# EAGLE design mixer-board4 (EAGLE 9.6.2)
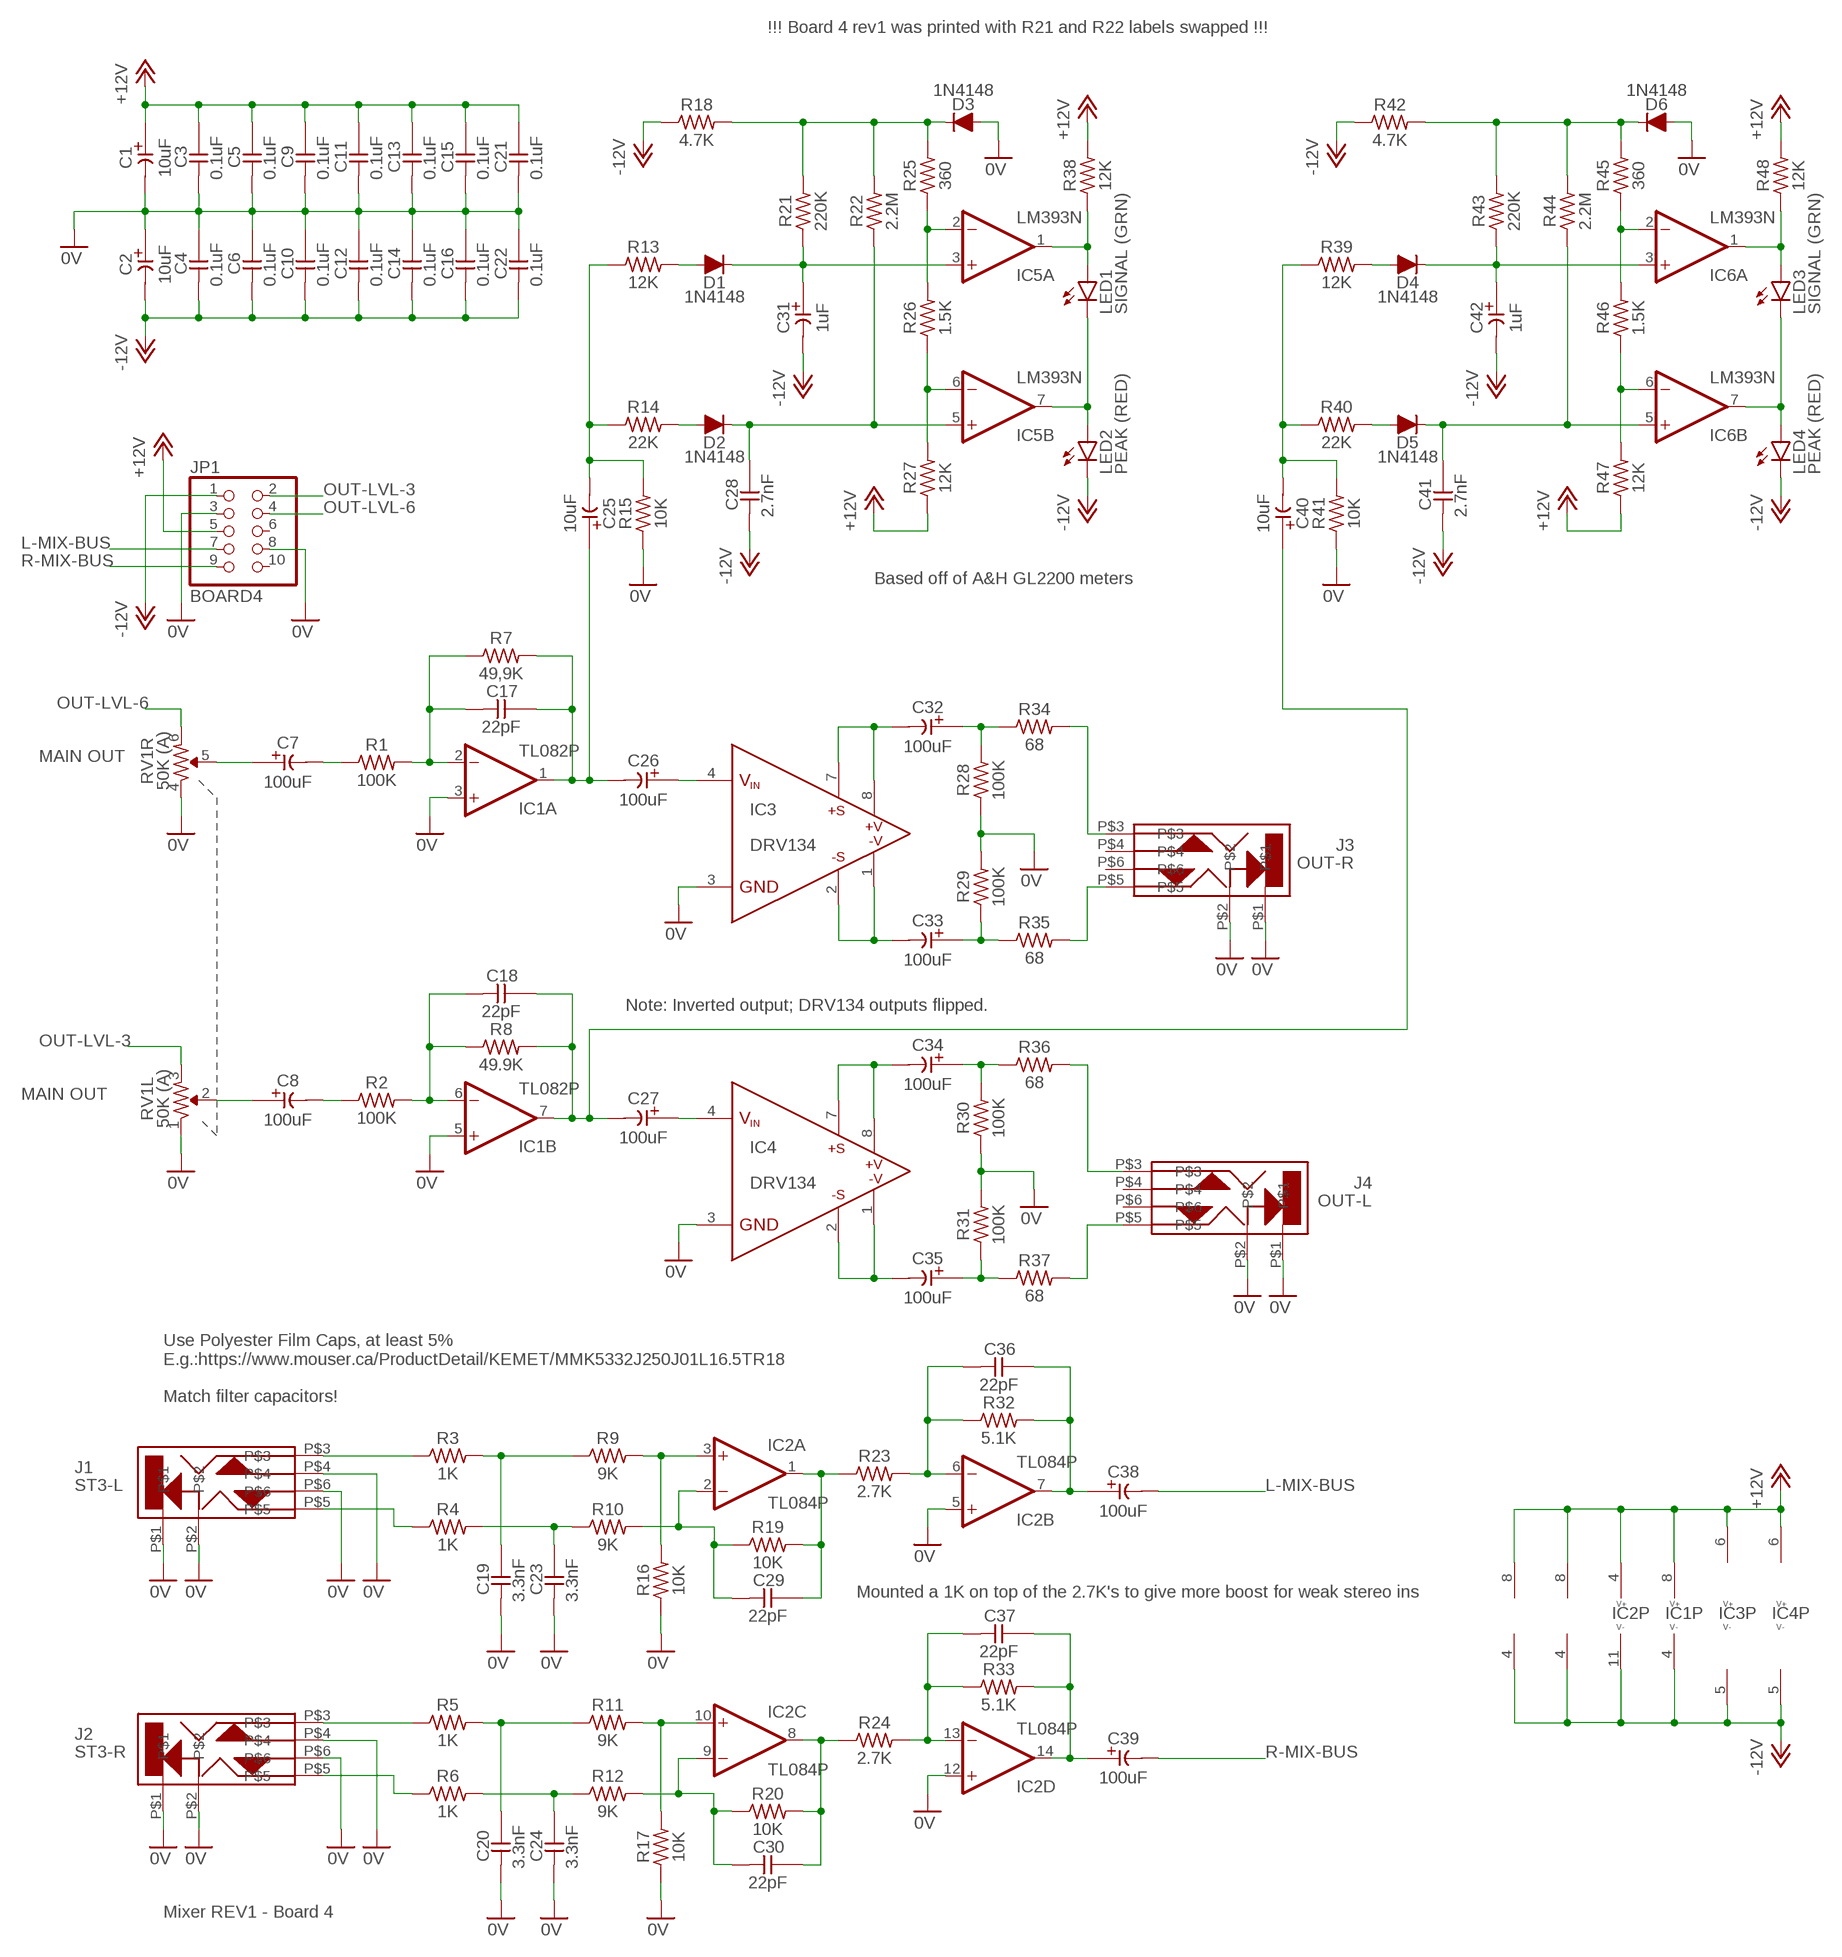
[diagram p0: schematic, sheet 1]

## Parts
C1  10uF  CE-USE2-5  [E2-5]
C2  10uF  CE-USE2-5  [E2-5]
C3  0.1uF  CC-US025-024X044  [C025-024X044]
C4  0.1uF  CC-US025-024X044  [C025-024X044]
C5  0.1uF  CC-US025-024X044  [C025-024X044]
C6  0.1uF  CC-US025-024X044  [C025-024X044]
C7  100uF  CE-USE5-8.5  [E5-8,5]
C8  100uF  CE-USE5-8.5  [E5-8,5]
C9  0.1uF  CC-US025-024X044  [C025-024X044]
C10  0.1uF  CC-US025-024X044  [C025-024X044]
C11  0.1uF  CC-US025-024X044  [C025-024X044]
C12  0.1uF  CC-US025-024X044  [C025-024X044]
C13  0.1uF  CC-US025-024X044  [C025-024X044]
C14  0.1uF  CC-US025-024X044  [C025-024X044]
C15  0.1uF  CC-US025-024X044  [C025-024X044]
C16  0.1uF  CC-US025-024X044  [C025-024X044]
C17  22pF  CC-US025-024X044  [C025-024X044]
C18  22pF  CC-US025-024X044  [C025-024X044]
C19  3.3nF  CC-US050-024X044  [C050-024X044]
C20  3.3nF  CC-US050-024X044  [C050-024X044]
C21  0.1uF  CC-US025-024X044  [C025-024X044]
C22  0.1uF  CC-US025-024X044  [C025-024X044]
C23  3.3nF  CC-US050-024X044  [C050-024X044]
C24  3.3nF  CC-US050-024X044  [C050-024X044]
C25  10uF  CE-USE2-5  [E2-5]
C26  100uF  CE-USE5-8.5  [E5-8,5]
C27  100uF  CE-USE5-8.5  [E5-8,5]
C28  2.7nF  CC-US025-024X044  [C025-024X044]
C29  22pF  CC-US025-024X044  [C025-024X044]
C30  22pF  CC-US025-024X044  [C025-024X044]
C31  1uF  CE-USE2-5  [E2-5]
C32  100uF  CE-USE5-8.5  [E5-8,5]
C33  100uF  CE-USE5-8.5  [E5-8,5]
C34  100uF  CE-USE5-8.5  [E5-8,5]
C35  100uF  CE-USE5-8.5  [E5-8,5]
C36  22pF  CC-US025-024X044  [C025-024X044]
C37  22pF  CC-US025-024X044  [C025-024X044]
C38  100uF  CE-USE5-8.5  [E5-8,5]
C39  100uF  CE-USE5-8.5  [E5-8,5]
C40  10uF  CE-USE2-5  [E2-5]
C41  2.7nF  CC-US025-024X044  [C025-024X044]
C42  1uF  CE-USE2-5  [E2-5]
D1  1N4148  [DO34-5]
D2  1N4148  [DO34-5]
D3  1N4148  [DO34-5]
D4  1N4148  [DO34-5]
D5  1N4148  [DO34-5]
D6  1N4148  [DO34-5]
IC1  TL082P  [DIL08]
IC2  TL084P  [DIL14]
IC3  DRV134  [DIL08]
IC4  DRV134  [DIL08]
IC5  LM393N  [DIL08]
IC6  LM393N  [DIL08]
J1  ST3-L  NYS216-U  [NYS216-U]
J2  ST3-R  NYS216-U  [NYS216-U]
J3  OUT-R  NYS216-U  [NYS216-U]
J4  OUT-L  NYS216-U  [NYS216-U]
JP1  BOARD4  PINHD-2X5  [2X05]
LED1  SIGNAL (GRN)  LED3MM  [LED3MM]
LED2  PEAK (RED)  LED3MM  [LED3MM]
LED3  SIGNAL (GRN)  LED3MM  [LED3MM]
LED4  PEAK (RED)  LED3MM  [LED3MM]
R1  100K  R  [0207/7]
R2  100K  R  [0207/7]
R3  1K  R  [0207/7]
R4  1K  R  [0207/7]
R5  1K  R  [0207/7]
R6  1K  R  [0207/7]
R7  49,9K  R  [0207/7]
R8  49.9K  R  [0207/7]
R9  9K  R  [0207/7]
R10  9K  R  [0207/7]
R11  9K  R  [0207/7]
R12  9K  R  [0207/7]
R13  12K  R  [0207/7]
R14  22K  R  [0207/7]
R15  10K  R  [0207/7]
R16  10K  R  [0207/7]
R17  10K  R  [0207/7]
R18  4.7K  R  [0207/7]
R19  10K  R  [0207/7]
R20  10K  R  [0207/7]
R21  220K  R  [0207/7]
R22  2.2M  R  [0207/7]
R23  2.7K  R  [0207/7]
R24  2.7K  R  [0207/7]
R25  360  R  [0207/7]
R26  1.5K  R  [0207/7]
R27  12K  R  [0207/7]
R28  100K  R  [0207/7]
R29  100K  R  [0207/7]
R30  100K  R  [0207/7]
R31  100K  R  [0207/7]
R32  5.1K  R  [0207/7]
R33  5.1K  R  [0207/7]
R34  68  R  [0207/7]
R35  68  R  [0207/7]
R36  68  R  [0207/7]
R37  68  R  [0207/7]
R38  12K  R  [0207/7]
R39  12K  R  [0207/7]
R40  22K  R  [0207/7]
R41  10K  R  [0207/7]
R42  4.7K  R  [0207/7]
R43  220K  R  [0207/7]
R44  2.2M  R  [0207/7]
R45  360  R  [0207/7]
R46  1.5K  R  [0207/7]
R47  12K  R  [0207/7]
R48  12K  R  [0207/7]
RV1  50K (A)  R-VAR-ST  [_COMMON_3RP/1610G]

## Nets
0V [power]: C1.- C2.+ C3.2 C4.1 C5.2 C6.1 C9.2 C10.1 C11.2 C12.1 C13.2 C14.1 C15.2 C16.1 C19.2 C20.2 C21.2 C22.1 C23.2 C24.2 D3.A D6.A IC1.3(A:+IN) IC1.5(B:+IN) IC2.5(B:+IN) IC2.12(D:+IN) IC3.3(GND) IC4.3(GND) J1.P$1 J1.P$2 J1.P$4 J1.P$6 J2.P$1 J2.P$2 J2.P$4 J2.P$6 J3.P$1 J3.P$2 J4.P$1 J4.P$2 JP1.3 JP1.8 R15.1 R16.1 R17.1 R28.1 R29.2 R30.1 R31.2 R41.1 RV1.1 RV1.4
+12V [power]: C1.+ C3.1 C5.1 C9.1 C11.1 C13.1 C15.1 C21.1 IC1.8(P:V+) IC2.4(P:V+) IC3.6(V+) IC4.6(V+) IC5.8(P:V+) IC6.8(P:V+) JP1.5 R27.1 R38.2 R47.1 R48.2
-12V [power]: C2.- C4.2 C6.2 C10.2 C12.2 C14.2 C16.2 C22.2 C28.2 C31.- C41.2 C42.- IC1.4(P:V-) IC2.11(P:V-) IC3.5(V-) IC4.5(V-) IC5.4(P:V-) IC6.4(P:V-) JP1.1 LED2.K(C) LED4.K(C) R18.1 R42.1
L-MIX-BUS: C38.- JP1.7
N$1: J2.P$3 R5.1
N$2: C20.1 R5.2 R11.1
N$3: IC2.10(C:+IN) R11.2 R17.2
N$4: C24.1 R6.2 R12.1
N$5: C30.2 IC2.9(C:-IN) R12.2 R20.1
N$6: J2.P$5 R6.1
N$7: C37.2 IC2.13(D:-IN) R24.2 R33.1
N$8: C30.1 IC2.8(C:OUT) R20.2 R24.1
N$9: J1.P$3 R3.1
N$10: C37.1 C39.+ IC2.14(D:OUT) R33.2
N$11: C19.1 R3.2 R9.1
N$12: IC2.3(A:+IN) R9.2 R16.2
N$13: C29.1 IC2.1(A:OUT) R19.2 R23.1
N$14: C36.2 IC2.6(B:-IN) R23.2 R32.1
N$15: C36.1 C38.+ IC2.7(B:OUT) R32.2
N$16: C23.1 R4.2 R10.1
N$17: J1.P$5 R4.1
N$20: C29.2 IC2.2(A:-IN) R10.2 R19.1
N$21: C7.+ RV1.5
N$22: C17.1 C25.+ C26.- IC1.1(A:OUT) R7.2
N$23: C8.+ RV1.2
N$24: C17.2 IC1.2(A:-IN) R1.2 R7.1
N$25: C8.- R2.1
N$26: C18.2 IC1.6(B:-IN) R2.2 R8.1
N$27: C18.1 C27.- C40.+ IC1.7(B:OUT) R8.2
N$28: C7.- R1.1
N$29: C32.- IC3.7(+SENSE) IC3.8(+V0)
N$30: C33.- IC3.1(-V0) IC3.2(-SENSE)
N$31: J4.P$3 R36.2
N$32: J4.P$5 R37.2
N$33: J3.P$5 R35.2
N$34: C26.+ IC3.4(VIN)
N$35: C27.+ IC4.4(VIN)
N$36: J3.P$3 R34.2
N$37: C35.- IC4.1(-V0) IC4.2(-SENSE)
N$38: C34.- IC4.7(+SENSE) IC4.8(+V0)
N$39: C34.+ R30.2 R36.1
N$40: C35.+ R31.1 R37.1
N$41: C33.+ R29.1 R35.1
N$42: C32.+ R28.2 R34.1
N$43: C25.- R13.1 R14.1 R15.2
N$44: D2.A R14.2
N$45: D1.A R13.2
N$46: C31.+ D1.C IC5.3(A:+IN) R21.1
N$47: C28.1 D2.C IC5.5(B:+IN) R22.1
N$48: IC5.6(B:-IN) R26.1 R27.2
N$49: IC5.2(A:-IN) R25.1 R26.2
N$50: D3.C R18.2 R21.2 R22.2 R25.2
N$51: IC5.1(A:OUT) LED1.A R38.1
N$52: IC5.7(B:OUT) LED1.K(C) LED2.A
N$53: C40.- R39.1 R40.1 R41.2
N$54: D5.A R40.2
N$55: D4.A R39.2
N$56: C42.+ D4.C IC6.3(A:+IN) R43.1
N$57: C41.1 D5.C IC6.5(B:+IN) R44.1
N$58: IC6.6(B:-IN) R46.1 R47.2
N$59: IC6.2(A:-IN) R45.1 R46.2
N$60: D6.C R42.2 R43.2 R44.2 R45.2
N$61: IC6.1(A:OUT) LED3.A R48.1
N$62: IC6.7(B:OUT) LED3.K(C) LED4.A
OUT-LVL-3: JP1.2 RV1.3
OUT-LVL-6: JP1.4 RV1.6
R-MIX-BUS: C39.- JP1.9
Unconnected: J3.P$4 J3.P$6 J4.P$4 J4.P$6 JP1.6 JP1.10

## Notes on the sheet
- !!! Board 4 rev1 was printed with R21 and R22 labels swapped !!!
- Based off of A&H GL2200 meters
- MAIN OUT
- Note: Inverted output; DRV134 outputs flipped.
- MAIN OUT
- Use Polyester Film Caps, at least 5%
  E.g.:https://www.mouser.ca/ProductDetail/KEMET/MMK5332J250J01L16.5TR18
  
  Match filter capacitors!
- Mounted a 1K on top of the 2.7K's to give more boost for weak stereo ins
- Mixer REV1 - Board 4

## Library data of the parts
C1 C2 C7 C8 C25-C27 C31-C35 C38-C40 C42 = _common:CE-US: ELECTROLYTIC CAPACITOR, US symbol
C3-C6 C9-C24 C28-C30 C36 C37 C41 = _common:CC-US: CAPACITOR, US symbol
D1-D6 = _common:1N4148: DIODE high speed (Philips)
IC1 = _common:TL082: OP AMP
IC2 = _common:TL084: OP AMP
IC3 IC4 = _common:DRV134: Texas Instruments AUDIO LINE DRIVER https://www.mouser.ca/ProductDetail/Texas-Instruments/DRV134PA Note: Scheduled for obsolescence and will be discontinued by the manufacturer.
IC5 IC6 = linear:LM393: COMPARATOR
J1-J4 = jacks:NYS216-U: https://www.mouser.ca/ProductDetail/REAN/NYS216-U Stereo (TRS) 1/4" Jack
JP1 = pinhead:PINHD-2X5: PIN HEADER
LED1-LED4 = led:LED: LED OSRAM: - CHIPLED LG R971, LG N971, LY N971, LG Q971, LY Q971, LO R971, LY R971 LH N974, LH R974 LS Q976, LO Q976, LY Q976 LO Q996 - Hyper CHIPLED LW Q18S LB Q993, LB Q99A, LB R99A - SideLED LS A670, LO A670, LY A670, LG A670, LP A670 LB A673, LV A673, LT A673, LW A673 LH A674 LY A675 LS A676, LA A676, LO A676, LY A676, LW A676 LS A679, LY A679, LG A679 - Hyper Micro SIDELED® LS Y876, LA Y876, LO Y876, LY Y876 LT Y87S - SmartLED LW L88C, LW L88S LB L89C, LB L89S, LG L890 LS L89K, LO L89K, LY L89K LS L896, LA L896, LO L896, LY L896 - TOPLED LS T670, LO T670, LY T670, LG T670, LP T670 LSG T670, LSP T670, LSY T670, LOP T670, LYG T670 LG T671, LOG T671, LSG T671 LB T673, LV T673, LT T673, LW T673 LH T674 LS T676, LA T676, LO T676, LY T676, LB T676, LH T676, LSB T676, LW T676 LB T67C, LV T67C, LT T67C, LS T67K, LO T67K, LY T67K, LW E67C LS E67B, LA E67B, LO E67B, LY E67B, LB E67C, LV E67C, LT E67C LW T67C LS T679, LY T679, LG T679 LS T770, LO T770, LY T770, LG T770, LP T770 LB T773, LV T773, LT T773, LW T773 LH T774 LS E675, LA E675, LY E675, LS T675 LS T776, LA T776, LO T776, LY T776, LB T776 LHGB T686 LT T68C, LB T68C - Hyper Mini TOPLED® LB M676 - Mini TOPLED Santana® LG M470 LS M47K, LO M47K, LY M47K Source: http://www.osram.convergy.de LUXEON: - LUMILED® LXK2-PW12-R00, LXK2-PW12-S00, LXK2-PW14-U00, LXK2-PW14-V00 LXK2-PM12-R00, LXK2-PM12-S00, LXK2-PM14-U00 LXK2-PE12-Q00, LXK2-PE12-R00, LXK2-PE12-S00, LXK2-PE14-T00, LXK2-PE14-U00 LXK2-PB12-K00, LXK2-PB12-L00, LXK2-PB12-M00, LXK2-PB14-N00, LXK2-PB14-P00, LXK2-PB14-Q00 LXK2-PR12-L00, LXK2-PR12-M00, LXK2-PR14-Q00, LXK2-PR14-R00 LXK2-PD12-Q00, LXK2-PD12-R00, LXK2-PD12-S00 LXK2-PH12-R00, LXK2-PH12-S00 LXK2-PL12-P00, LXK2-PL12-Q00, LXK2-PL12-R00 Source: www.luxeon.com KINGBRIGHT: KA-3528ASYC Source: www.kingbright.com
R1-R48 = _common:R: RESISTOR, US symbol
RV1 = _common:R-VAR-ST

## Net classes
0 default: width 0.305 mm, clearance 0.305 mm
1 power: width 0.711 mm, clearance 0.305 mm

## Board
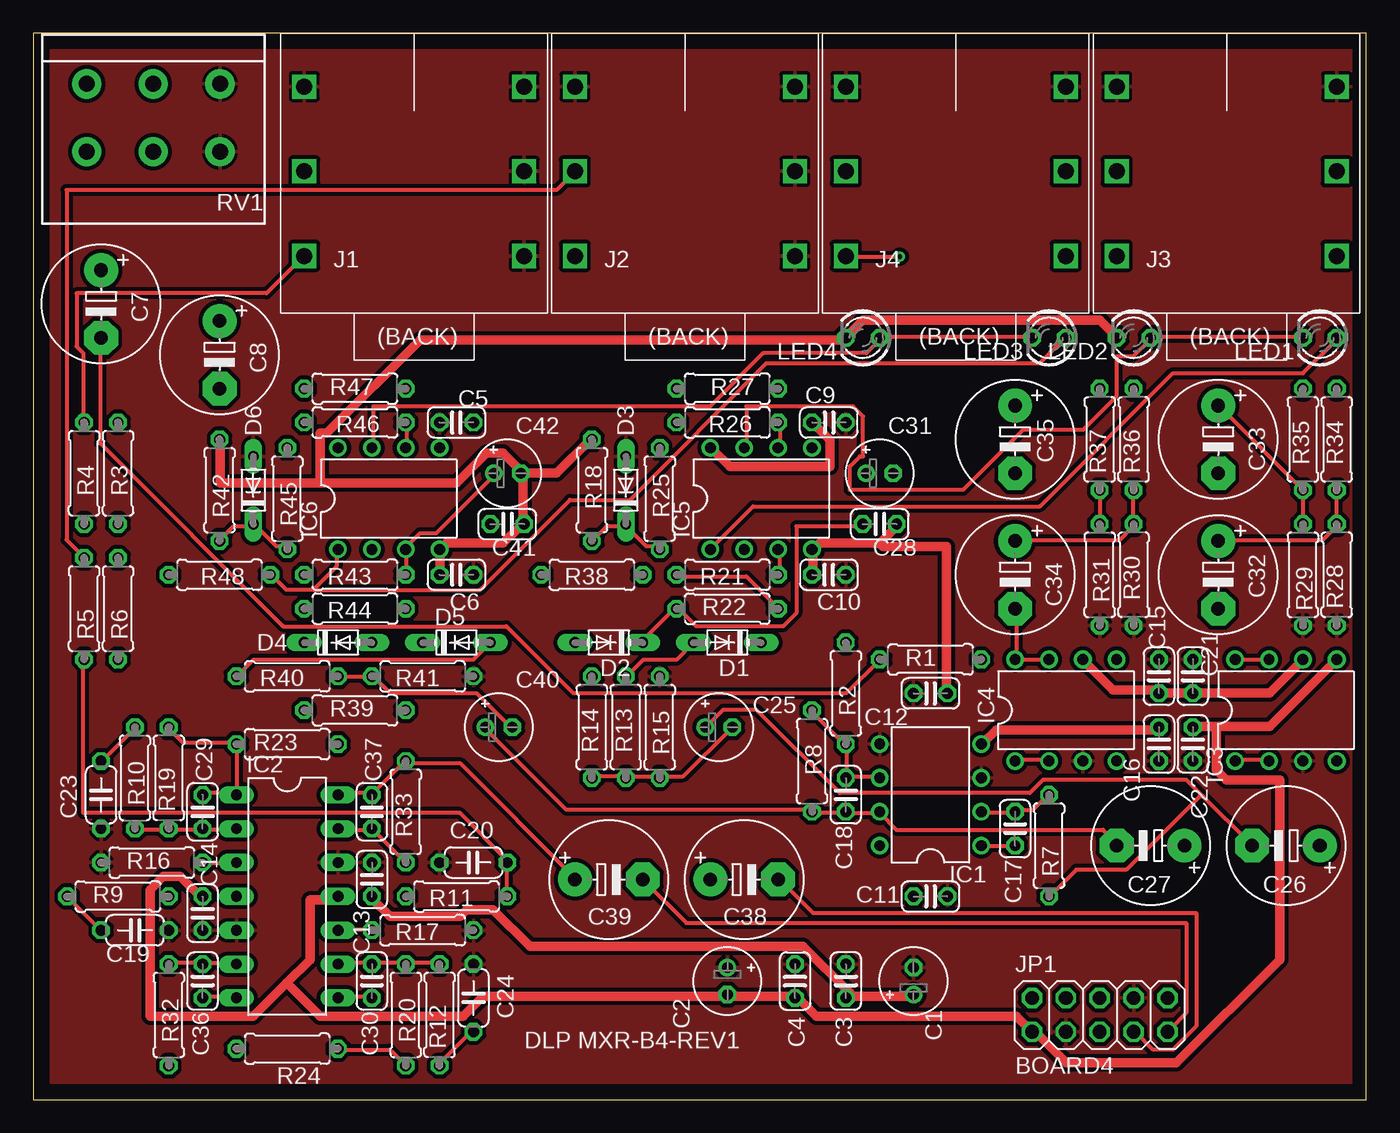
[diagram p1: board, top side]
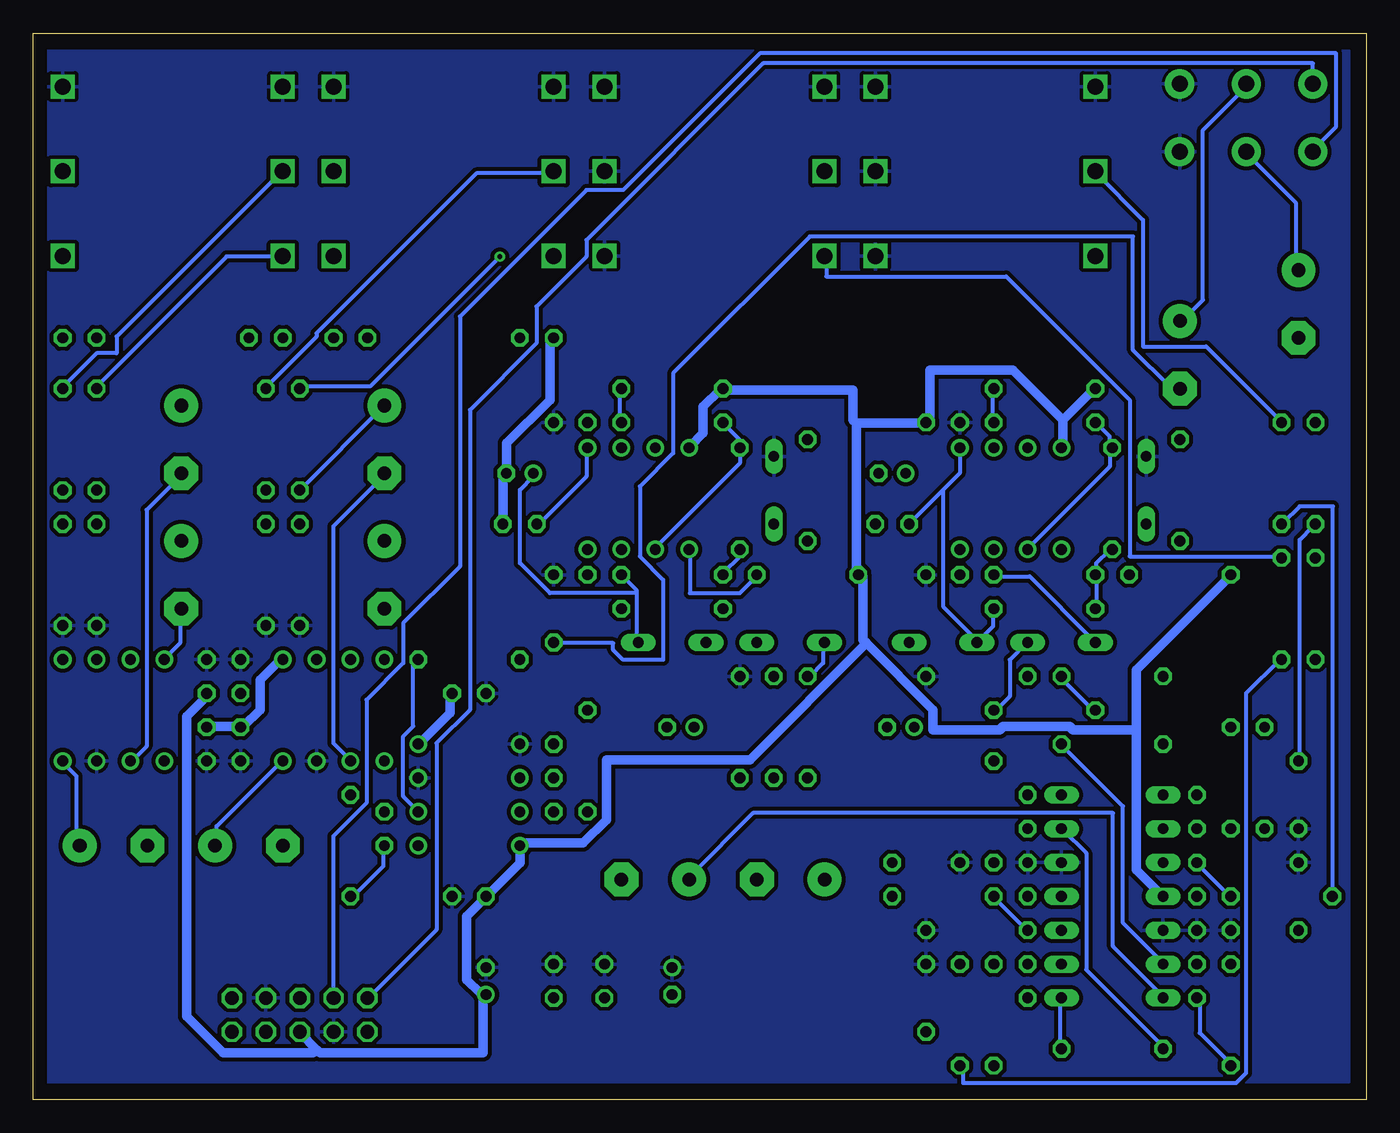
[diagram p2: board, bottom side, seen from below]

Size 100 x 80 mm. Coordinates in mm from the lower left corner, seen from the top.
Outline: 0,0 100,0 100,80 0,80 0,0
Copper layers (1*16): Top 0.035mm / dielectric 1.5mm / Bottom 0.035mm
Design rules "default": minimum track width 6mil, minimum drill 0.35mm, track to track 6mil, track to pad 6mil, pad to pad 6mil, via to via 6mil, smd to smd 6mil, copper to edge 40mil, drill to drill 6mil, minimum pad ring 10mil, minimum via ring 8mil, stop-mask expansion 4mil, vias tented up to drill 0mil, thermal gap 10mil

### Footprints (pad centres in the part's own frame; a part is rotated, then mirrored left to right if it is on the bottom)
E2-5 = drill 0.813 pad 1.27: + -1.016,0 | drill 0.813 pad 1.27 octagon: - 1.016,0
C025-024X044 = drill 0.813 octagon: 1 -1.27,0; 2 1.27,0
E5-8,5 = drill 1.016 pad 2.54: + -2.54,0 | drill 1.016 pad 2.54 octagon: - 2.54,0
C050-024X044 = drill 0.813 octagon: 1 -2.54,0; 2 2.54,0
DO34-5 = drill 0.813 long: A 2.54,0; C -2.54,0
DIL08 = drill 0.813 pad 1.27: 1 -3.81,-3.81; 2 -1.27,-3.81; 3 1.27,-3.81; 4 3.81,-3.81; 5 3.81,3.81; 6 1.27,3.81; 7 -1.27,3.81; 8 -3.81,3.81
DIL14 = drill 0.813 long: 1 -7.62,-3.81; 2 -5.08,-3.81; 3 -2.54,-3.81; 4 0,-3.81; 5 2.54,-3.81; 6 5.08,-3.81; 7 7.62,-3.81; 8 7.62,3.81; 9 5.08,3.81; 10 2.54,3.81; 11 0,3.81; 12 -2.54,3.81; 13 -5.08,3.81; 14 -7.62,3.81
NYS216-U = drill 1.2 square: P$1 0,0; P$2 16.5,0; P$3 0,-6.35; P$4 16.5,-6.35; P$5 0,-12.7; P$6 16.5,-12.7
2X05 = drill 1.016 octagon: 1 -5.08,-1.27; 2 -5.08,1.27; 3 -2.54,-1.27; 4 -2.54,1.27; 5 0,-1.27; 6 0,1.27; 7 2.54,-1.27; 8 2.54,1.27; 9 5.08,-1.27; 10 5.08,1.27
LED3MM = drill 0.813 octagon: A -1.27,0; K 1.27,0
0207/7 = drill 0.813 octagon: 1 -3.81,0; 2 3.81,0
_COMMON_3RP/1610G = drill 1.2 pad 2.184: 1 -5,0; 2 0,0; 3 5,0; 4 -5,5.08; 5 0,5.08; 6 5,5.08

### Placement (x,y rotation side)
C1  66.04,8.89 90 top
C2  52.07,8.89 270 top
C3  60.96,8.89 90 top
C4  57.15,8.89 270 top
C5  31.75,50.8 180 top
C6  31.75,39.37 180 top
C7  5.08,59.69 270 top
C8  13.97,55.88 270 top
C9  59.69,50.8 0 top
C10  59.69,39.37 180 top
C11  67.31,15.24 0 top
C12  67.31,30.48 0 top
C13  25.4,16.51 90 top
C14  12.7,13.97 90 top
C15  84.45,31.75 90 top
C16  84.45,26.67 90 top
C17  73.66,20.32 90 top
C18  60.96,22.86 90 top
C19  7.62,12.7 0 top
C20  33.02,17.78 180 top
C21  87,31.75 90 top
C22  87,26.67 90 top
C23  5.08,22.86 270 top
C24  33.02,7.62 90 top
C25  51.44,27.94 0 top
C26  93.98,19.05 180 top
C27  83.82,19.05 180 top
C28  63.5,43.18 0 top
C29  12.7,21.59 270 top
C30  25.4,8.89 90 top
C31  63.5,46.99 0 top
C32  88.9,39.37 270 top
C33  88.9,49.53 270 top
C34  73.66,39.37 270 top
C35  73.66,49.53 270 top
C36  12.7,8.89 90 top
C37  25.4,21.59 270 top
C38  53.34,16.51 0 top
C39  43.18,16.51 0 top
C40  34.92,27.94 0 top
C41  35.56,43.18 0 top
C42  35.56,46.99 0 top
D1  52.07,34.29 180 top
D2  43.18,34.29 180 top
D3  44.45,45.72 90 top
D4  22.86,34.29 0 top
D5  31.75,34.29 0 top
D6  16.51,45.72 90 top
IC1  67.31,22.86 90 top
IC2  19.05,15.24 270 top
IC3  93.98,29.21 0 top
IC4  77.47,29.21 0 top
IC5  54.61,45.09 0 top
IC6  26.67,45.09 0 top
J1  20.32,76 0 top
J2  40.64,76 0 top
J3  81.28,76 0 top
J4  60.96,76 0 top
JP1  80.01,6.35 0 top
LED1  96.52,57.15 180 top
LED2  82.55,57.15 180 top
LED3  76.2,57.15 180 top
LED4  62.23,57.15 180 top
R1  67.31,33.02 0 top
R2  60.96,30.48 270 top
R3  6.35,46.99 270 top
R4  3.81,46.99 270 top
R5  3.81,36.83 270 top
R6  6.35,36.83 270 top
R7  76.2,19.05 270 top
R8  58.42,25.4 270 top
R9  6.35,15.24 0 top
R10  7.62,24.13 270 top
R11  31.75,15.24 180 top
R12  30.48,6.35 90 top
R13  44.45,27.94 90 top
R14  41.91,27.94 90 top
R15  46.99,27.94 270 top
R16  8.89,17.78 0 top
R17  29.21,12.7 180 top
R18  41.91,45.72 270 top
R19  10.16,24.13 90 top
R20  27.94,6.35 270 top
R21  52.07,39.37 180 top
R22  52.07,36.83 0 top
R23  19.05,26.67 0 top
R24  19.05,3.81 180 top
R25  46.99,45.09 270 top
R26  52.07,50.8 180 top
R27  52.07,53.34 0 top
R28  97.79,39.37 90 top
R29  95.25,39.37 270 top
R30  82.55,39.37 90 top
R31  80.01,39.37 270 top
R32  10.16,6.35 270 top
R33  27.94,21.59 90 top
R34  97.79,49.53 90 top
R35  95.25,49.53 90 top
R36  82.55,49.53 90 top
R37  80.01,49.53 90 top
R38  41.91,39.37 180 top
R39  24.13,29.21 0 top
R40  19.05,31.75 180 top
R41  29.21,31.75 180 top
R42  13.97,45.72 270 top
R43  24.13,39.37 180 top
R44  24.13,36.83 180 top
R45  19.05,45.09 270 top
R46  24.13,50.8 180 top
R47  24.13,53.34 0 top
R48  13.97,39.37 180 top
RV1  9,76.2 180 top

### Tracks (layer width: path | path; a pad name or v marks a point on that pad's centre or on a via)
0V
  pour Top: 1.27,1.27 99.06,1.27 99.06,78.74 1.27,78.74
  pour Bottom: 1.27,1.27 99.06,1.27 99.06,78.74 1.27,78.74
+12V
  Top 0.711: C9.1 58.5,50.75 59.75,49.5 59.75,47.5 52.25,47.5 51,48.75 IC5.8 | IC4.6 78.75,33 81,30.75 84.25,30.75 C15.1 84.5,30.5 86.75,30.5 C21.1 87.25,30.5 92.75,30.5 95.25,33 IC3.6 | C1.+ 66,7.75 61,7.75 C3.1 61.25,8 57.75,11.5 37.25,11.5 34.5,14.25 32.5,14.25 32,13.75 26.75,13.75 25.5,15 C13.1
  Bottom 0.711: IC2.4 17.25,17.25 17.25,27.75 | 17.25,27.75 17.25,32.25 10.25,39.25 R48.2 | IC5.8 50.75,49 49.75,50 49.75,52 48.5,53.25 R27.1 48,53.25 38.5,53.25 38.5,51 38.25,50.75 | 22.75,51 20.5,53.25 R47.1 | 22.75,51 22.75,49 IC6.8 | 38.25,50.75 33.25,50.75 C5.1 32.75,51 32.75,54.75 26.5,54.75 22.75,51 | 38.25,50.75 38.25,39.5 R38.2 37.75,39.25 37.75,34.5 37.5,34.25 | 17.25,27.75 22,27.75 22.25,28 27.25,28 27.5,27.75 32.5,27.75 32.5,29.25 37.5,34.25 | 78.75,3.75 78.5,3.5 66.25,3.5 66.25,7.75 C1.+ 66.5,8 67.5,9 67.5,13.75 66.25,15 C11.1 66,15.25 63.5,17.75 IC1.8 63.25,19.25 58.75,19.25 57,21 57,25.5 46.25,25.5 37.5,34.25 | 78.75,3.75 80,5 JP1.5 | C21.1 87,30.25 88.5,28.75 88.5,6.25 85.75,3.5 79,3.5 78.75,3.75
-12V
  Top 0.711: 19,8.75 20.75,10.5 20.75,15 22.75,15 IC2.11 | 19,8.75 16.5,6.25 8.75,6.25 8.75,15.75 9.75,16.75 11,16.75 12.5,15.25 C14.2 | 19,8.75 21.5,6.25 32.25,6.25 33.75,7.75 51.75,7.75 C2.- 52.25,7.75 57,7.75 C4.2 57.5,7.5 58.75,6.25 73.75,6.25 74.75,5.25 JP1.1 75.25,5 77.5,2.75 85.75,2.75 93.5,10.5 93.5,24 89.5,24 88.75,24.75 88.75,28 | C6.2 30.5,39.5 30.5,41.25 IC6.4 30.75,41.5 31,41.75 35.25,41.75 36.5,43 C41.2 36.75,43.25 36.75,46.75 C42.- | 21.5,46.25 31.75,46.25 34,48.5 35.25,48.5 36.5,47.25 C42.- | 21.5,46.25 14,46.25 14,49.5 R42.1 | R18.1 41.75,49.5 39.25,47 37,47 C42.- | 88.75,28 87,28 C22.2 | 88.75,28 92.75,28 97.75,33 IC3.5 | IC1.4 71.25,26.75 72.25,27.75 84.25,27.75 C16.2 | C10.2 58.5,39.5 58.5,41.25 IC5.4 58.75,41.5 59,41.75 63.5,41.75 | LED2.K 81.25,57.25 80,58.5 62.25,58.5 61,57.25 LED4.K 60.75,57 29,57 22,50 21.5,50 21.5,46.25 | 63.5,41.75 64.75,43 C28.2 | C12.2 68.5,30.5 68.5,41.5 63.75,41.5 63.5,41.75
  Bottom 0.711: IC1.4 71,26.75 68.75,29 68.75,30.25 C12.2 | IC4.5 81.5,33 83,31.5 83,29.25 84.25,28 C16.2 84.75,28 86.75,28 C22.2 | C28.2 64.75,43.25 64.75,46.75 C31.- 64.5,47.25 64.5,49.25 61.25,52.5 61.25,56.75 61,57 LED4.K
L-MIX-BUS
  Top 0.305: JP1.7 82.75,5 84,3.75 85.5,3.75 87.25,5.5 87.25,14 58.5,14 56,16.5 C38.-
N$1
  Top 0.305: R5.1 3.75,40.75 2.5,42 2.5,68.25 39.25,68.25 40.5,69.5 J2.P$3
N$2
  Top 0.305: R11.1 35.5,15.25 35.5,17.75 C20.1 35.5,18 32,21.5 3.75,21.5 3.75,33 R5.2
N$3
  Top 0.305: IC2.10 23,12.75 25.25,12.75 R17.2
  Bottom 0.305: R11.2 27.75,15 25.5,12.75 R17.2
N$4
  Top 0.305: R12.1 30.5,2.75 32.75,5 33,5 C24.1
  Bottom 0.305: R6.2 6.5,33 9,30.5 9,2 9.75,1.25 30.25,1.25 30.25,2.5 R12.1
N$5
  Top 0.305: IC2.9 23,10.25 25.25,10.25 C30.2 25.5,10.25 27.75,10.25 R20.1 28,10.25 30.25,10.25 R12.2
N$6
  Bottom 0.305: R6.1 6.5,40.75 17.75,40.75 17.75,52.5 27,61.75 40.5,61.75 40.5,63.25 J2.P$5
N$7
  Top 0.305: IC2.13 23,20.25 25.25,20.25 C37.2 25.5,20.25 27.75,18 R33.1
  Bottom 0.305: R24.2 15.25,4 21,9.75 21,18.5 22.75,20.25 IC2.13
N$8
  Top 0.305: R20.2 27.75,2.75 26.75,3.75 23,3.75 R24.1 | C30.1 25.25,7.75 23,7.75 IC2.8
  Bottom 0.305: R24.1 23,4 23,7.5 IC2.8
N$9
  Bottom 0.305: R3.1 6.5,51 12,56.5 16.75,56.5 16.75,66 20.25,69.5 J1.P$3
N$10
  Top 0.305: IC2.14 23,23 25.25,23 C37.1 25.5,23 27.75,25.25 R33.2 28,25.25 32,25.25 40.5,16.75 C39.+
N$11
  Top 0.305: C19.1 5,12.75 2.75,15 R9.1
  Bottom 0.305: R3.2 6.25,43.25 5,44.5 2.5,44.5 2.5,15.25 R9.1
N$12
  Top 0.305: IC2.3 15,17.75 12.75,17.75 R16.2
  Bottom 0.305: R9.2 10.25,15.25 12.5,17.5 12.5,17.75 R16.2
N$13
  Top 0.305: C29.1 12.75,23 15,23 IC2.1 15.25,23 15.25,26.5 R23.1 15,26.75 11.25,26.75 10.25,27.75 R19.2
N$14
  Top 0.305: R32.1 10.25,10.25 12.5,10.25 C36.2 12.75,10.25 15,10.25 IC2.6
  Bottom 0.305: R23.2 22.75,26.5 18.25,22 18.25,13.25 15.25,10.25 IC2.6
N$15
  Top 0.305: IC2.7 15,7.75 12.75,7.75 C36.1
  Bottom 0.305: R32.2 10.25,2.75 12.5,5 12.5,7.5 C36.1 | C38.+ 50.75,16.75 46,21.5 19,21.5 19,11.5 15.25,7.75 IC2.7
N$16
  Top 0.305: C23.1 5.25,25.5 7.5,27.75 R10.1
  Bottom 0.305: R4.2 4,43 5,42 5,25.5 C23.1
N$17
  Top 0.305: R4.1 3.75,51 3.75,56 3.25,56.5 3.25,60.5 17.5,60.5 20.25,63.25 J1.P$5
N$20
  Top 0.305: R10.2 7.75,20.25 10,20.25 R19.1 10.25,20.25 12.5,20.25 C29.2 12.75,20.25 15,20.25 IC2.2
N$21
  Bottom 0.305: RV1.5 9,71 5.25,67.25 5.25,62.25 C7.+
N$22
  Top 0.305: IC1.1 71.25,19 73.5,19 C17.1 | 87.75,22.75 91.25,19.25 C26.- | 87.75,22.75 86.5,24 75.75,24 74.75,23 60.5,23 54.25,29.25 51.75,29.25 50.5,28 C25.+ | 87.75,22.75 87.5,22.75 82,17.25 78.25,17.25 76.25,15.25 R7.2
  Bottom 0.305: R7.2 76,15.25 73.75,17.5 73.75,19 C17.1
N$23
  Bottom 0.305: RV1.2 9,76 12.25,72.75 12.25,60 13.75,58.5 C8.+
N$24
  Top 0.305: IC1.2 71.25,21.5 73.5,21.5 C17.2 73.75,21.75 75,21.75 76,22.75 R7.1
  Bottom 0.305: R1.2 71.25,33 71.5,32.75 71.5,28 72.25,27.25 72.25,22.75 71.25,21.75 IC1.2
N$25
  Bottom 0.305: R2.1 60.75,34.25 56.5,34.25 56.5,33.75 55.75,33 52.75,33 52.75,39 54.5,40.75 54.5,46 52,48.5 52,54.5 41.75,64.75 17.5,64.75 17.5,56.25 14.75,53.5 14,53.5 C8.-
N$26
  Top 0.305: 61,24.25 61,26.5 R2.2 60.75,26.75 58.5,29 R8.1 | 61,24.25 63.5,24.25 IC1.6 | 61,24.25 C18.2
N$27
  Top 0.305: 63.5,21.5 61,21.5 C18.1 60.75,21.5 58.5,21.5 R8.2 58.25,21.75 40,21.75 34,27.75 C40.+ | 63.5,21.5 64.75,20.25 80.25,20.25 81.25,19.25 C27.- | 63.5,21.5 IC1.7
N$28
  Top 0.305: R1.1 63.5,33 61,30.5 40.5,30.5 35.5,35.5 18.75,35.5 5,49.25 5,57 C7.-
N$29
  Top 0.305: IC3.8 90.25,33 92.5,33 IC3.7
  Bottom 0.305: IC3.8 90,33.25 89,34.25 89,36.75 C32.-
N$30
  Top 0.305: IC3.1 90.25,25.5 92.5,25.5 IC3.2
  Bottom 0.305: IC3.2 92.5,25.5 91.5,26.5 91.5,44.25 89,46.75 C33.-
N$31
  Bottom 0.305: R36.2 82.5,53.5 78.75,57.25 78.75,57.5 66.75,69.5 61,69.5 J4.P$3
N$32  (via drill 0.35)
  Top 0.305: v65,63.25 61,63.25 J4.P$5
  Bottom 0.305: v65,63.25 74.75,53.5 80,53.5 R37.2
N$33
  Bottom 0.305: R35.2 95.25,53.5 85.5,63.25 81.5,63.25 J3.P$5
N$34
  Bottom 0.305: IC3.4 97.75,25.25 96.75,24.25 96.75,19.25 C26.+
N$35
  Bottom 0.305: IC4.4 81.5,25.25 86.25,20.5 86.25,19.25 C27.+
N$36
  Bottom 0.305: R34.2 97.75,53.5 95.25,56 93.75,56 93.75,57.25 81.5,69.5 J3.P$3
N$37
  Top 0.305: IC4.1 73.75,25.5 76,25.5 IC4.2
  Bottom 0.305: IC4.2 76.25,25.5 77.5,26.75 77.5,43 73.75,46.75 C35.-
N$38
  Top 0.305: IC4.7 76,33 73.75,33 IC4.8 73.75,33.25 73.75,36.75 C34.-
N$39
  Top 0.305: R36.1 82.5,45.5 82.5,43.25 R30.2 82.5,43 81.5,42 73.75,42 C34.+
N$40
  Top 0.305: R31.1 80,43.25 80,45.5 R37.1
  Bottom 0.305: R37.1 80,45.75 73.75,52 C35.+
N$41
  Top 0.305: R29.1 R35.1 95.25,45.75 89,52 C33.+
N$42
  Top 0.305: R34.1 97.75,45.5 97.75,43.25 R28.2 97.75,43 96.75,42 89,42 C32.+
N$43
  Top 0.305: R14.1 42,24.25 44.25,24.25 R13.1 44.5,24.25 46.75,24.25 R15.2 47,24.25 48.75,24.25 52.25,27.75 C25.-
N$44
  Bottom 0.305: R14.2 41.75,31.75 40.75,32.75 40.75,34.25 D2.A
N$45
  Top 0.305: R13.2 44.5,31.75 45.75,33 48.25,33 49.5,34.25 D1.A
N$46
  Top 0.305: IC5.3 56,41.25 56,39.5 R21.1
  Bottom 0.305: 54.75,38 54.75,38.25 55.75,39.25 R21.1 | 54.75,38 54.75,34.5 D1.C | 54.75,38 61.25,38 63.5,40.25 63.5,45.75 62.5,46.75 C31.+
N$47
  Top 0.305: D2.C 45.75,34.5 48,36.75 48.25,36.75 R22.1 48.5,36.75 49.75,35.5 56.25,35.5 57.25,36.5 57.25,43 62,43 C28.1
  Bottom 0.305: C28.1 62,43.25 58.5,46.75 58.5,48.75 IC5.5
N$48
  Top 0.305: IC5.6 56,49 56,50.75 R26.1
  Bottom 0.305: R27.2 56,53.25 56,51 R26.1
N$49
  Bottom 0.305: IC5.2 53.25,41.5 47,47.75 47,48.75 R25.1 47,49 47,49.5 48.25,50.75 R26.2
N$50
  Top 0.305: R18.2 43,43 44.25,43 D3.C 44.5,43 46,41.5 46.75,41.5 R25.2 | R22.2 55.75,37 53.5,39.25 48.5,39.25 R21.2
  Bottom 0.305: R21.2 48.25,39.5 47,40.75 47,41.25 R25.2
N$51
  Top 0.305: LED1.A 97.75,57 95.25,54.5 85.5,54.5 75.5,44.5 54,44.5 51,41.5 IC5.1
  Bottom 0.305: R38.1 45.75,39.25 47,38 50.75,38 50.75,41.25 IC5.1
N$52
  Top 0.305: IC5.7 53.5,49 53.5,52 61.5,52 62.25,51.25 62.25,48.25 62,48.25 61.25,47.5 61.25,45.75 69.75,45.75 74.25,50.25 78.75,50.25 81.25,52.75 81.25,55.75 82.5,55.75 83.75,57 LED2.A 84,57.25 95.25,57.25 LED1.K
N$53
  Top 0.305: R40.1 R41.2 25.5,31.75 26.75,30.5 33.25,30.5 35.75,28 C40.-
  Bottom 0.305: R39.1 20.5,29.25 22.75,31.5 22.75,31.75 R40.1
N$54
  Top 0.305: D5.A 33,33 16.5,33 R40.2
N$55
  Bottom 0.305: R39.2 27.75,29.25 26.75,30.25 26.75,33 25.5,34.25 D4.A
N$56
  Top 0.305: R43.1 28,39.5 28,41.25 IC6.3 28,41.5 29,42.5 30.25,42.5 34.5,46.75 C42.+
  Bottom 0.305: D4.C 20.5,34.5 25.25,39.25 27.75,39.25 R43.1
N$57
  Bottom 0.305: R44.1 28,36.75 28,35.5 D5.C 29.25,34.5 31.75,37 31.75,45.75 | 31.75,45.75 30.5,47 30.5,48.75 IC6.5 | 31.75,45.75 34.25,43.25 C41.1
N$58
  Top 0.305: IC6.6 28,49 28,50.75 R46.1
  Bottom 0.305: R47.2 28,53.25 28,51 R46.1
N$59
  Bottom 0.305: IC6.2 25.25,41.5 19.25,47.5 19.25,48.75 R45.1 19.25,49 19.25,49.75 20.25,50.75 R46.2
N$60
  Top 0.305: R42.2 14,42 15,43 16.5,43 D6.C 16.75,43 18.25,41.5 19,41.5 R45.2
  Bottom 0.305: R44.2 20.25,37 20.25,39.25 R43.2 20.25,39.5 20.25,40.25 19.25,41.25 R45.2
N$61
  Top 0.305: 21,38.25 19,38.25 18,39.25 R48.1 | 21,38.25 22.75,40 22.75,41.25 IC6.1 | 21,38.25 33.5,38.25 40.25,45 44.75,45 55,55.25 75.5,55.25 77.25,57 LED3.A
N$62
  Top 0.305: IC6.7 25.5,49 25.5,52 50.75,52 54.75,56 62.5,56 63.5,57 LED4.A 63.5,57.25 74.75,57.25 LED3.K
OUT-LVL-3
  Bottom 0.305: RV1.3 4,77.75 45.25,77.75 58.5,64.5 58.5,63.25 62.25,59.5 62.25,56.75 67.25,51.75 67.25,29.25 69.75,26.75 69.75,12.75 74.75,7.75 JP1.2
OUT-LVL-6
  Bottom 0.305: JP1.4 77.5,7.75 77.5,19.75 75,22.25 75,30 72.25,32.75 72.25,35.75 68,40 68,58.75 58.5,68.25 55.75,68.25 45.5,78.5 2.25,78.5 2.25,73 4,71.25 RV1.6
R-MIX-BUS
  Top 0.305: JP1.9 85.25,5.25 86.5,6.5 86.5,13.25 49,13.25 45.75,16.5 C39.-

### Text on the board
tPlace: BOARD4
tNames: DLP MXR-B4-REV1